# Altium project ar488_driver.PrjPcb
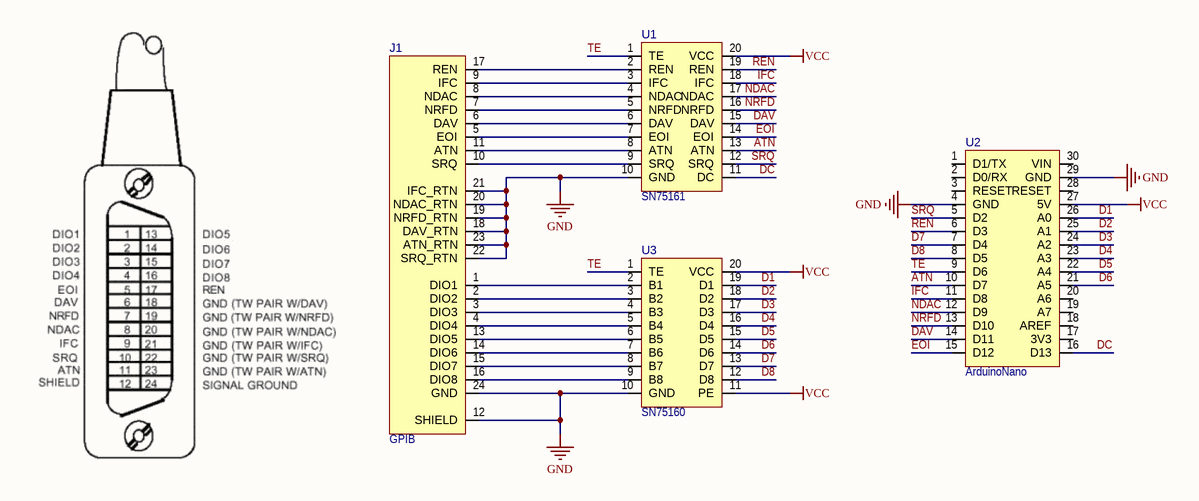
[diagram p0: ar488_driver_schematic.SchDoc]
1 sheet, 4 parts. Net scope: global (net labels, ports and power ports of the same name join across sheets).
Board file: ar488_driver_pcb.PcbDoc

## Sheet ar488_driver_schematic.SchDoc: AR488 Driver Board with Arduino Nano
size Letter; SheetNumber: 1; SheetTotal: 1

### Parts
J1  GPIB  [GPIB]
U1  SN75161  [SN75161]
U2  ArduinoNano  [NANO]
U3  SN75160  [SN75160]

### Nets
GND: J1.12(SHIELD) J1.18(DAV_RTN) J1.19(NRFD_RTN) J1.20(NDAC_RTN) J1.21(IFC_RTN) J1.22(SRQ_RTN) J1.23(ATN_RTN) J1.24(GND) U1.10(GND) U2.4(GND) U2.29(GND) U3.10(GND)
VCC: U1.20(VCC) U2.27(5V) U3.11(PE) U3.20(VCC)
ATN: U1.13(ATN) U2.10(D7)
D1: U2.26(A0) U3.19(D1)
D2: U2.25(A1) U3.18(D2)
D3: U2.24(A2) U3.17(D3)
D4: U2.23(A3) U3.16(D4)
D5: U2.22(A4) U3.15(D5)
D6: U2.21(A5) U3.14(D6)
D7: U2.7(D4) U3.13(D7)
D8: U2.8(D5) U3.12(D8)
DAV: U1.15(DAV) U2.14(D11)
DC: U1.11(DC) U2.16(D13)
EOI: U1.14(EOI) U2.15(D12)
IFC: U1.18(IFC) U2.11(D8)
NDAC: U1.17(NDAC) U2.12(D9)
NRFD: U1.16(NRFD) U2.13(D10)
REN: U1.19(REN) U2.6(D3)
SRQ: U1.12(SRQ) U2.5(D2)
TE: U1.1(TE) U2.9(D6) U3.1(TE)
NetJ1_1: J1.1(DIO1) U3.2(B1)
NetJ1_2: J1.2(DIO2) U3.3(B2)
NetJ1_3: J1.3(DIO3) U3.4(B3)
NetJ1_4: J1.4(DIO4) U3.5(B4)
NetJ1_5: J1.5(EOI) U1.7(EOI)
NetJ1_6: J1.6(DAV) U1.6(DAV)
NetJ1_7: J1.7(NRFD) U1.5(NRFD)
NetJ1_8: J1.8(NDAC) U1.4(NDAC)
NetJ1_9: J1.9(IFC) U1.3(IFC)
NetJ1_10: J1.10(SRQ) U1.9(SRQ)
NetJ1_11: J1.11(ATN) U1.8(ATN)
NetJ1_13: J1.13(DIO5) U3.6(B5)
NetJ1_14: J1.14(DIO6) U3.7(B6)
NetJ1_15: J1.15(DIO7) U3.8(B7)
NetJ1_16: J1.16(DIO8) U3.9(B8)
NetJ1_17: J1.17(REN) U1.2(REN)

Not connected (* = marked no-connect by the designer): U2 1(D1/TX) 2(D0/RX) 3(RESET) 17(3V3) 18(AREF) 19(A7) 20(A6) 28(RESET) 30(VIN)

### Notes on the sheet
- Last Modified
- Drawn by Alexander Osborne
- www.osborneee.com <http://www.osborneee.com>
- www.github.com/amosborne <http://www.github.com/amosborne>
- Sheet
- www.linkedin.com/in/alexander-m-osborne/ <http://www.linkedin.com/in/alexander-m-osborne/>
- of

### Library data of the parts
J1 = GPIB: Wire-to-Board GPIB Connections
U1 = SN75161: Octal General-Purpose Interface Bus Tranceiver; Supplier 1: Mouser; Supplier Part Number 1: 595-SN75161BN
U2 = ArduinoNano: Arduino Nano; Supplier 1: Mouser; Supplier Part Number 1: 782-A000005
U3 = SN75160: Octal General-Purpose Interface Bus Tranceiver; Supplier 1: Mouser; Supplier Part Number 1: 595-SN75160BN